# EAGLE design gatilho3 (EAGLE 7.5.0)
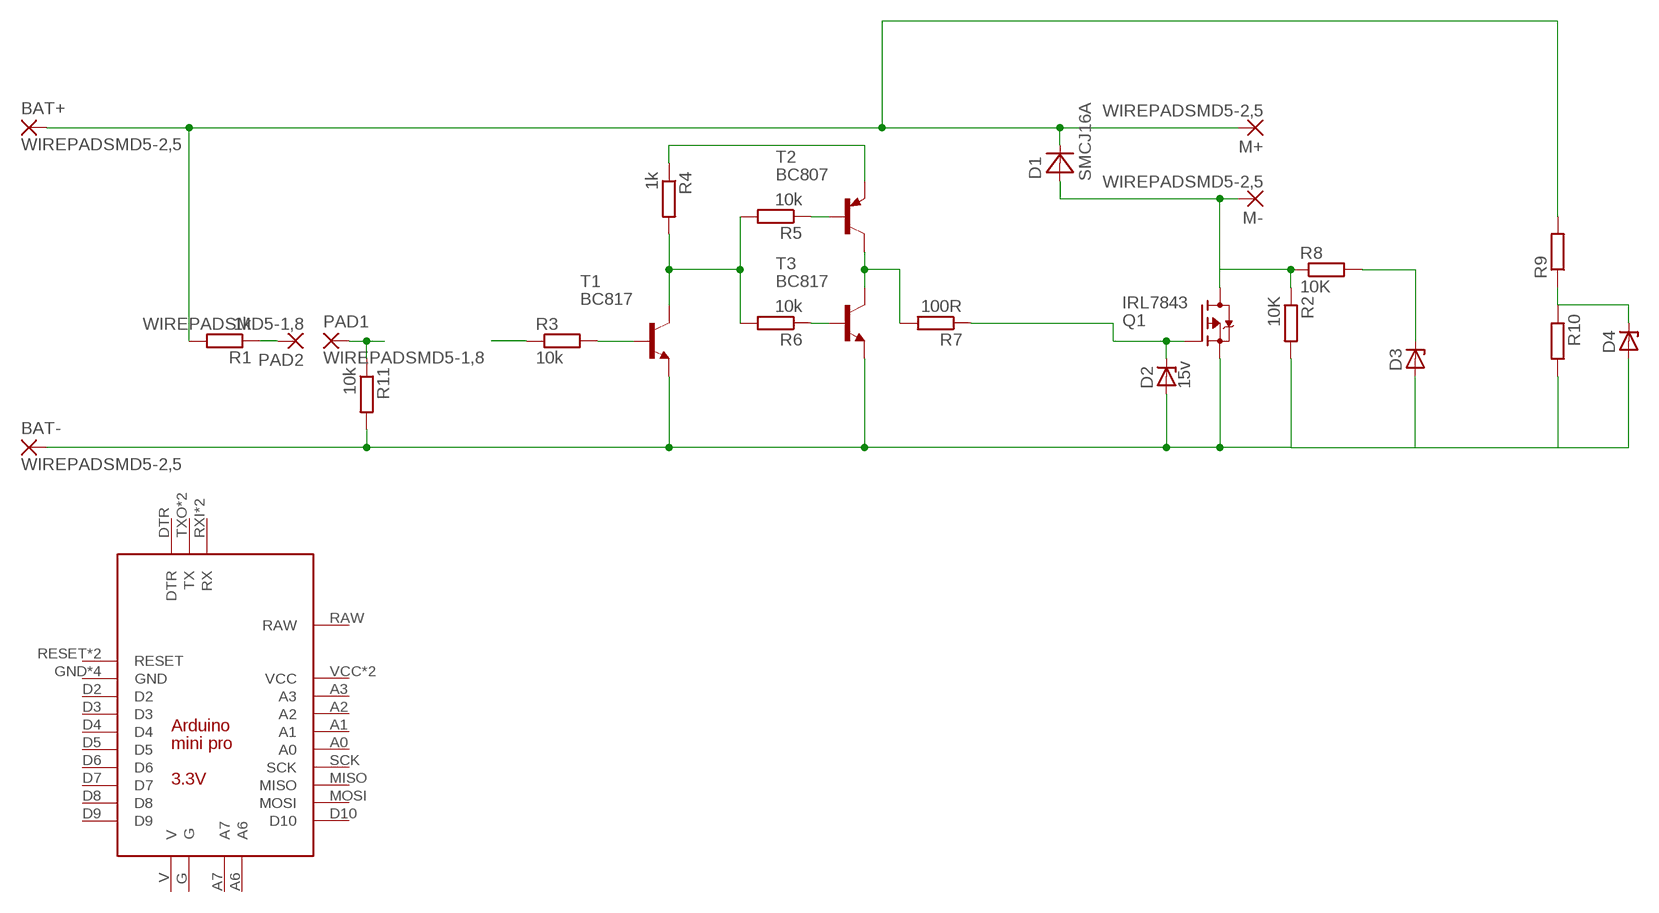
[diagram p0: schematic, sheet 1]

## Parts
BAT+  WIREPADSMD5-2,5  [5-2,5]
BAT-  WIREPADSMD5-2,5  [5-2,5]
D1  SMCJ16A  MBRA340T3  [SMA]
D2  15v  ZENER-DIODESOD80C  [SOD80C]
D3  ZENER-DIODESOD80C  [SOD80C]
D4  ZENER-DIODESOD80C  [SOD80C]
M+  WIREPADSMD5-2,5  [5-2,5]
M-  WIREPADSMD5-2,5  [5-2,5]
PAD1  WIREPADSMD5-1,8  [5-1,8]
PAD2  WIREPADSMD5-1,8  [5-1,8]
Q1  IRL7843  FDD4141TO252  [TO252]
R1  1k  R-EU_R0805  [R0805]
R2  10K  R-EU_R0805  [R0805]
R3  10k  R-EU_R0805  [R0805]
R4  1k  R-EU_R0805  [R0805]
R5  10k  R-EU_R0805  [R0805]
R6  10k  R-EU_R0805  [R0805]
R7  100R  R-EU_R0805  [R0805]
R8  10K  R-EU_R0805  [R0805]
R9  R-EU_R0805  [R0805]
R10  R-EU_R0805  [R0805]
R11  10k  R-EU_R0805  [R0805]
T1  BC817  MMBT3904LT1-NPN-SOT23-BEC  [SOT23-BEC]
T2  BC807  MMBT3906LT1-PNP-SOT23-BEC  [SOT23-BEC]
T3  BC817  MMBT3904LT1-NPN-SOT23-BEC  [SOT23-BEC]
U$1  ARDUINO_MINI_PRO_3V3  [ARDUINO_MINI_PRO_3V3]

## Nets
N$1: BAT-.1(P) D2.A D3.A D4.A Q1.2(S) R2.2 R10.2 R11.2 T1.E T3.E
N$2: D1.A M-.1(P) Q1.3(D) R2.1 R8.1
N$3: D4.C R9.1 R10.1
N$4: PAD2.1(P) R1.1
N$5: BAT+.1(P) D1.C M+.1(P) R1.2 R9.2
N$6: PAD1.1(P) R11.1
N$7: R3.1
N$8: D3.C R8.2
N$9: R4.1 T2.E
N$11: R4.2 R5.2 R6.2 T1.C
N$12: R3.2 T1.B
N$13: R7.2 T2.C T3.C
N$15: R5.1 T2.B
N$16: R6.1 T3.B
N$17: D2.C Q1.1(G) R7.1
Unconnected: U$1.A0 U$1.A1 U$1.A2 U$1.A3 U$1.A6 U$1.A7 U$1.D2 U$1.D3 U$1.D4 U$1.D5 U$1.D6 U$1.D7 U$1.D8 U$1.D9 U$1.D10 U$1.DTR U$1.G U$1.GND U$1.GND2(GND) U$1.GND3(GND) U$1.GND4(GND) U$1.MISO U$1.MOSI U$1.RAW U$1.RESET U$1.RESET2(RESET) U$1.RXI2(RX) U$1.RXI(RX) U$1.SCK U$1.TXO2(TX) U$1.TXO(TX) U$1.V U$1.VCC U$1.VCC2(VCC)

## Library data of the parts
BAT+ BAT- M+ M- PAD1 PAD2 = wirepad:WIREPAD: Wire PAD connect wire on PCB
D1 = diode:MBRA340T3: Surface Mount Schottky Power Rectifier Source: http://www.onsemi.com/pub_link/Collateral/MBRA340T3-D.PDF
D2-D4 = diode:ZENER-DIODE: Z-Diode
Q1 = transistor-fet:FDD4141: P-Channel PowerTrench® MOSFET Source: FDD4141.pdf
R1-R11 = resistor:R-EU_: RESISTOR, European symbol
T1 T3 = transistor-neu-to92:*-NPN-: NPN Transistror
T2 = transistor:*-PNP-: PNP Transistror
U$1 = eBay parts:ARDUINO_MINI_PRO_3V3: 3.3 V Arduino pro module from eBay NOTE: Untested layout; ARDUINO: 3.3V

## Board
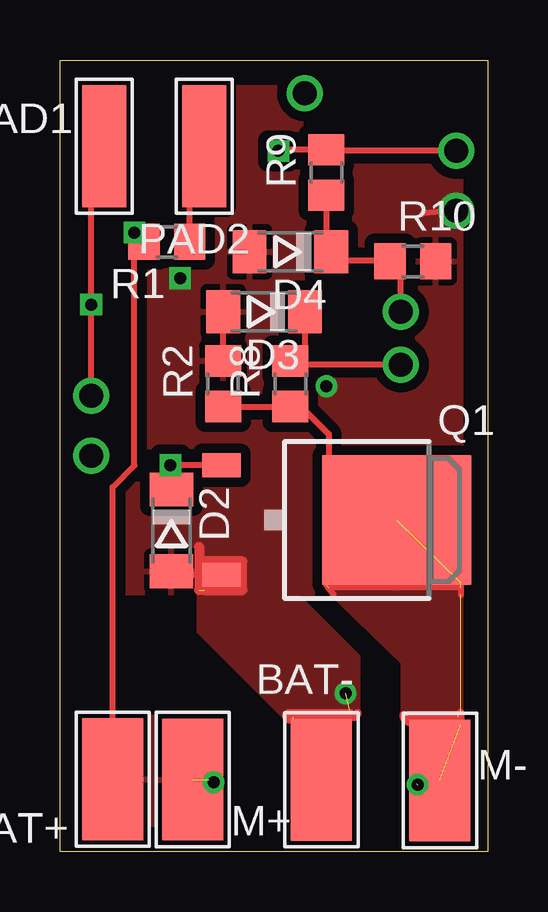
[diagram p1: board, top side]
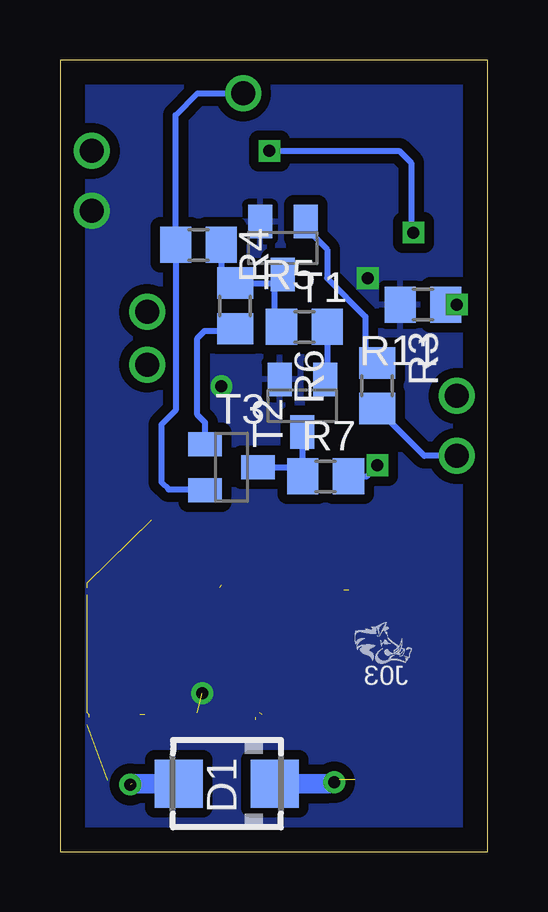
[diagram p2: board, bottom side, seen from below]

Size 17.83 x 32.99 mm. Coordinates in mm from the lower left corner, seen from the top.
Outline: 17.82,32.99 0,32.99 0,0 17.82,0
Outline: 17.83,32.99 17.83,0
Copper layers (1*16): Top 0.035mm / dielectric 1.5mm / Bottom 0.035mm
Design rules "default": minimum track width 10mil, minimum drill 24mil, track to track 8mil, track to pad 8mil, pad to pad 8mil, via to via 8mil, smd to smd 8mil, copper to edge 40mil, drill to drill 8mil, minimum pad ring 10mil, minimum via ring 8mil, stop-mask expansion 4mil, vias tented up to drill 0mil, thermal gap 10mil

### Footprints (pad centres in the part's own frame; a part is rotated, then mirrored left to right if it is on the bottom)
5-2,5 = smd 2.54 x 5.08: 1 0,0
SMA = smd 2 x 2: A 2,0; C -2,0
SOD80C = smd 1.4 x 1.8: A 1.7,0; C -1.7,0
5-1,8 = smd 1.829 x 5.08: 1 0,0
TO252 = smd 1 x 1.6: 1 -2.28,-4.8; 2 2.28,-4.8 | smd 5.4 x 6.2: 3 0,2.5
R0805 = smd 1.3 x 1.5: 1 -0.95,0; 2 0.95,0
SOT23-BEC = smd 1 x 1.4: B -0.95,-1.1; C 0,1.1; E 0.95,-1.1
ARDUINO_MINI_PRO_3V3 = drill 1.016 pad 1.88: A0 7.62,-5.08; A1 7.62,-2.54; A2 7.62,0; A3 7.62,2.54; A6 5.08,-15.24; A7 2.54,-15.24; D2 -7.62,2.54; D3 -7.62,0; D4 -7.62,-2.54; D5 -7.62,-5.08; D6 -7.62,-7.62; D7 -7.62,-10.16; D8 -7.62,-12.7; D9 -7.62,-15.24; D10 7.62,-15.24; DTR 6.35,15.24; G -2.54,-15.24; GND -7.62,5.08; GND2 7.62,10.16; GND3 -6.35,15.24; GND4 -3.81,15.24; MISO 7.62,-10.16; MOSI 7.62,-12.7; RAW 7.62,12.7; RESET -7.62,7.62; RESET2 7.62,7.62; RXI -7.62,10.16; RXI2 1.27,15.24; SCK 7.62,-7.62; TXO -7.62,12.7; TXO2 3.81,15.24; V -5.08,-15.24; VCC 7.62,5.08; VCC2 -1.27,15.24

### Placement (x,y rotation side)
BAT+  2.19,3.03 180 top
BAT-  10.89,3 0 top
D1  10.87,2.84 180 bottom
D2  4.65,13.39 270 top
D3  8.5,22.5 180 top
D4  9.6,25 180 top
M+  5.53,3.01 180 top
M-  15.83,2.97 0 top
PAD1  1.85,29.4 180 top
PAD2  6,29.4 0 top
Q1  11.53,13.82 270 top
R1  4.45,25.41 180 top
R2  6.8,19.5 90 top
R3  4.61,19.42 90 bottom
R4  12.05,25.29 0 bottom
R5  10.53,22.75 90 bottom
R6  7.65,21.88 180 bottom
R7  6.76,15.64 180 bottom
R8  9.6,19.5 90 top
R9  11.1,28.3 90 top
R10  14.7,24.6 0 top
R11  2.7,22.8 180 bottom
T1  8.54,25.15 180 bottom
T2  10.68,16.02 270 bottom
T3  7.73,18.58 180 bottom
U$1  30.9,16 0 top  (outside the outline)

### Tracks (layer width: path | path; a pad name or v marks a point on that pad's centre or on a via)
N$1  (via drill 0.5, 1)  (4 unrouted)
  Top 0.254: Q1.2 4.39,11.54 D2.A | R2.2 D3.A | v16.5,26.7 15.1,26.6
  Top 0.305: 9.7,5.6 12.2,5.6 arc90 12.4,5.8 | 12.1,5.8 9.5,5.8 | 9.7,5.5 9.6,5.5 arc-90 9.4,5.7
  Top 0.406: 6,10.9 7.6,10.9 7.6,12.1 6,12.1 | 5.8,12.7 5.8,10.9
  Top 1.27: BAT-.1
  other vias: 11.9,6.6 11.1,19.4 5,23.9
  pour Bottom (isolate 0.406): 0.1,33 17.8,33 17.8,0.1 0.1,0.1
  pour Top: 12.4,5.6 12.4,8.1 8.4,12.1 6,12.1 5.8,11.9 5.8,9.2 9.5,5.5 12.3,5.5
  pour Top (isolate 0.406): 0,33 17.9,33 17.9,10.8 0,10.8
N$2  (via drill 0.5)  (9 unrouted)
  Top 0.254: R2.1 R8.1 10.05,18.55 11.2,17.4 11.2,16.3 11.5,16 11.85,16 Q1.3 | v14.9,2.8 15.66,2.8 M-.1 | 16.7,11 11.2,11 | 11.1,11.1 11.4,10.7 | 16.7,11.2 16.7,10.7
  Top 0.305: 16.6,5.6 14.5,5.6 | 14.5,5.7 16.6,5.7 | 16.7,5.3 16.7,5.8 | 14.6,5.4 arc-90 14.3,5.7
  Bottom 0.813: D1.A 14.84,2.84
  pour Top: 11,11.1 11.1,11 14.3,7.9 14.3,5.7 14.6,5.4 17,5.4 17.2,5.6 17.2,11 17.1,11.1
N$3  (via drill 1)
  Top 0.254: 14.2,24.55 R10.1 | R9.1 11.1,25.2 D4.C 11.65,24.65 13.7,24.65 R10.1 | v14.2,22.5 14.2,24.15 R10.1
N$4
  Top 0.254: R1.1 5.4,28.8 PAD2.1
N$5  (via drill 0.5, 1)  (1 unrouted)
  Top 0.254: BAT+.1 2.19,15.2 3.1,16.1 v3.1,25.8 3.1,25.2 R1.2 | v16.5,29.2 11.15,29.2 R9.2 9.15,29.25 v9.1,29.2
  Top 0.406: v6.4,2.9 6.2,3
  Bottom 0.254: v9.1,29.2 3.7,29.2 3.2,28.7 3.2,25.8 v3.1,25.8
  Bottom 0.406: 6.64,2.84 v6.4,2.9
  Bottom 0.813: D1.C 6.64,2.84
  pour Top: 3.3,5.6 4.4,5.6 4.4,0.5 3.4,0.5 3.4,5.5
N$6  (via drill 0.5, 1)
  Top 0.254: v1.3,19 v1.3,22.8 1.3,28.85 PAD1.1
  Bottom 0.254: R11.1 v1.3,22.8
N$7  (via drill 1)
  Bottom 0.254: v1.3,16.5 2.64,16.5 R3.1
N$8  (via drill 1)
  Top 0.254: D3.C 10.2,20.25 R8.2 9.85,20.3 v14.2,20.3
N$9  (via drill 1)
  Bottom 0.254: T2.E 11.81,15.1 13.3,15.1 13.6,15.4 13.6,17.8 13.01,18.39 R4.1 13.01,30.7 12.1,31.6 v10.2,31.6
N$11
  Bottom 0.254: R5.2 8.9,23.7 | 8.9,23.7 T1.C | R5.2 10.53,23.62 10.5,23.59 | R4.2 11.11,24.27 R5.2 | 8.9,23.7 8.9,22.18 R6.2
N$12
  Bottom 0.254: T1.B 7.59,25.99 6.7,25.1 6.7,23.9 5.1,22.3 5.1,20.86 R3.2
N$13
  Bottom 0.254: T2.C 8.09,16.02 R7.2 7.73,15.66 T3.C
N$15
  Bottom 0.254: T2.B 11.78,17.88 12.1,18.2 12.1,21.4 11.8,21.7 10.62,21.7 R5.1
N$16
  Bottom 0.254: R6.1 6.7,19.77 T3.B
N$17  (via drill 0.5)
  Top 0.254: Q1.1 v4.6,16.1 4.64,16.05 D2.C 4.6,15.13
  Bottom 0.254: R7.1 5.05,15.64 v4.6,16.1

### Text on the board
bPlace: J03